# EasyEDA Pro project ProPrj_火车手动控制开关_2025-05-28.epro, board PCB2
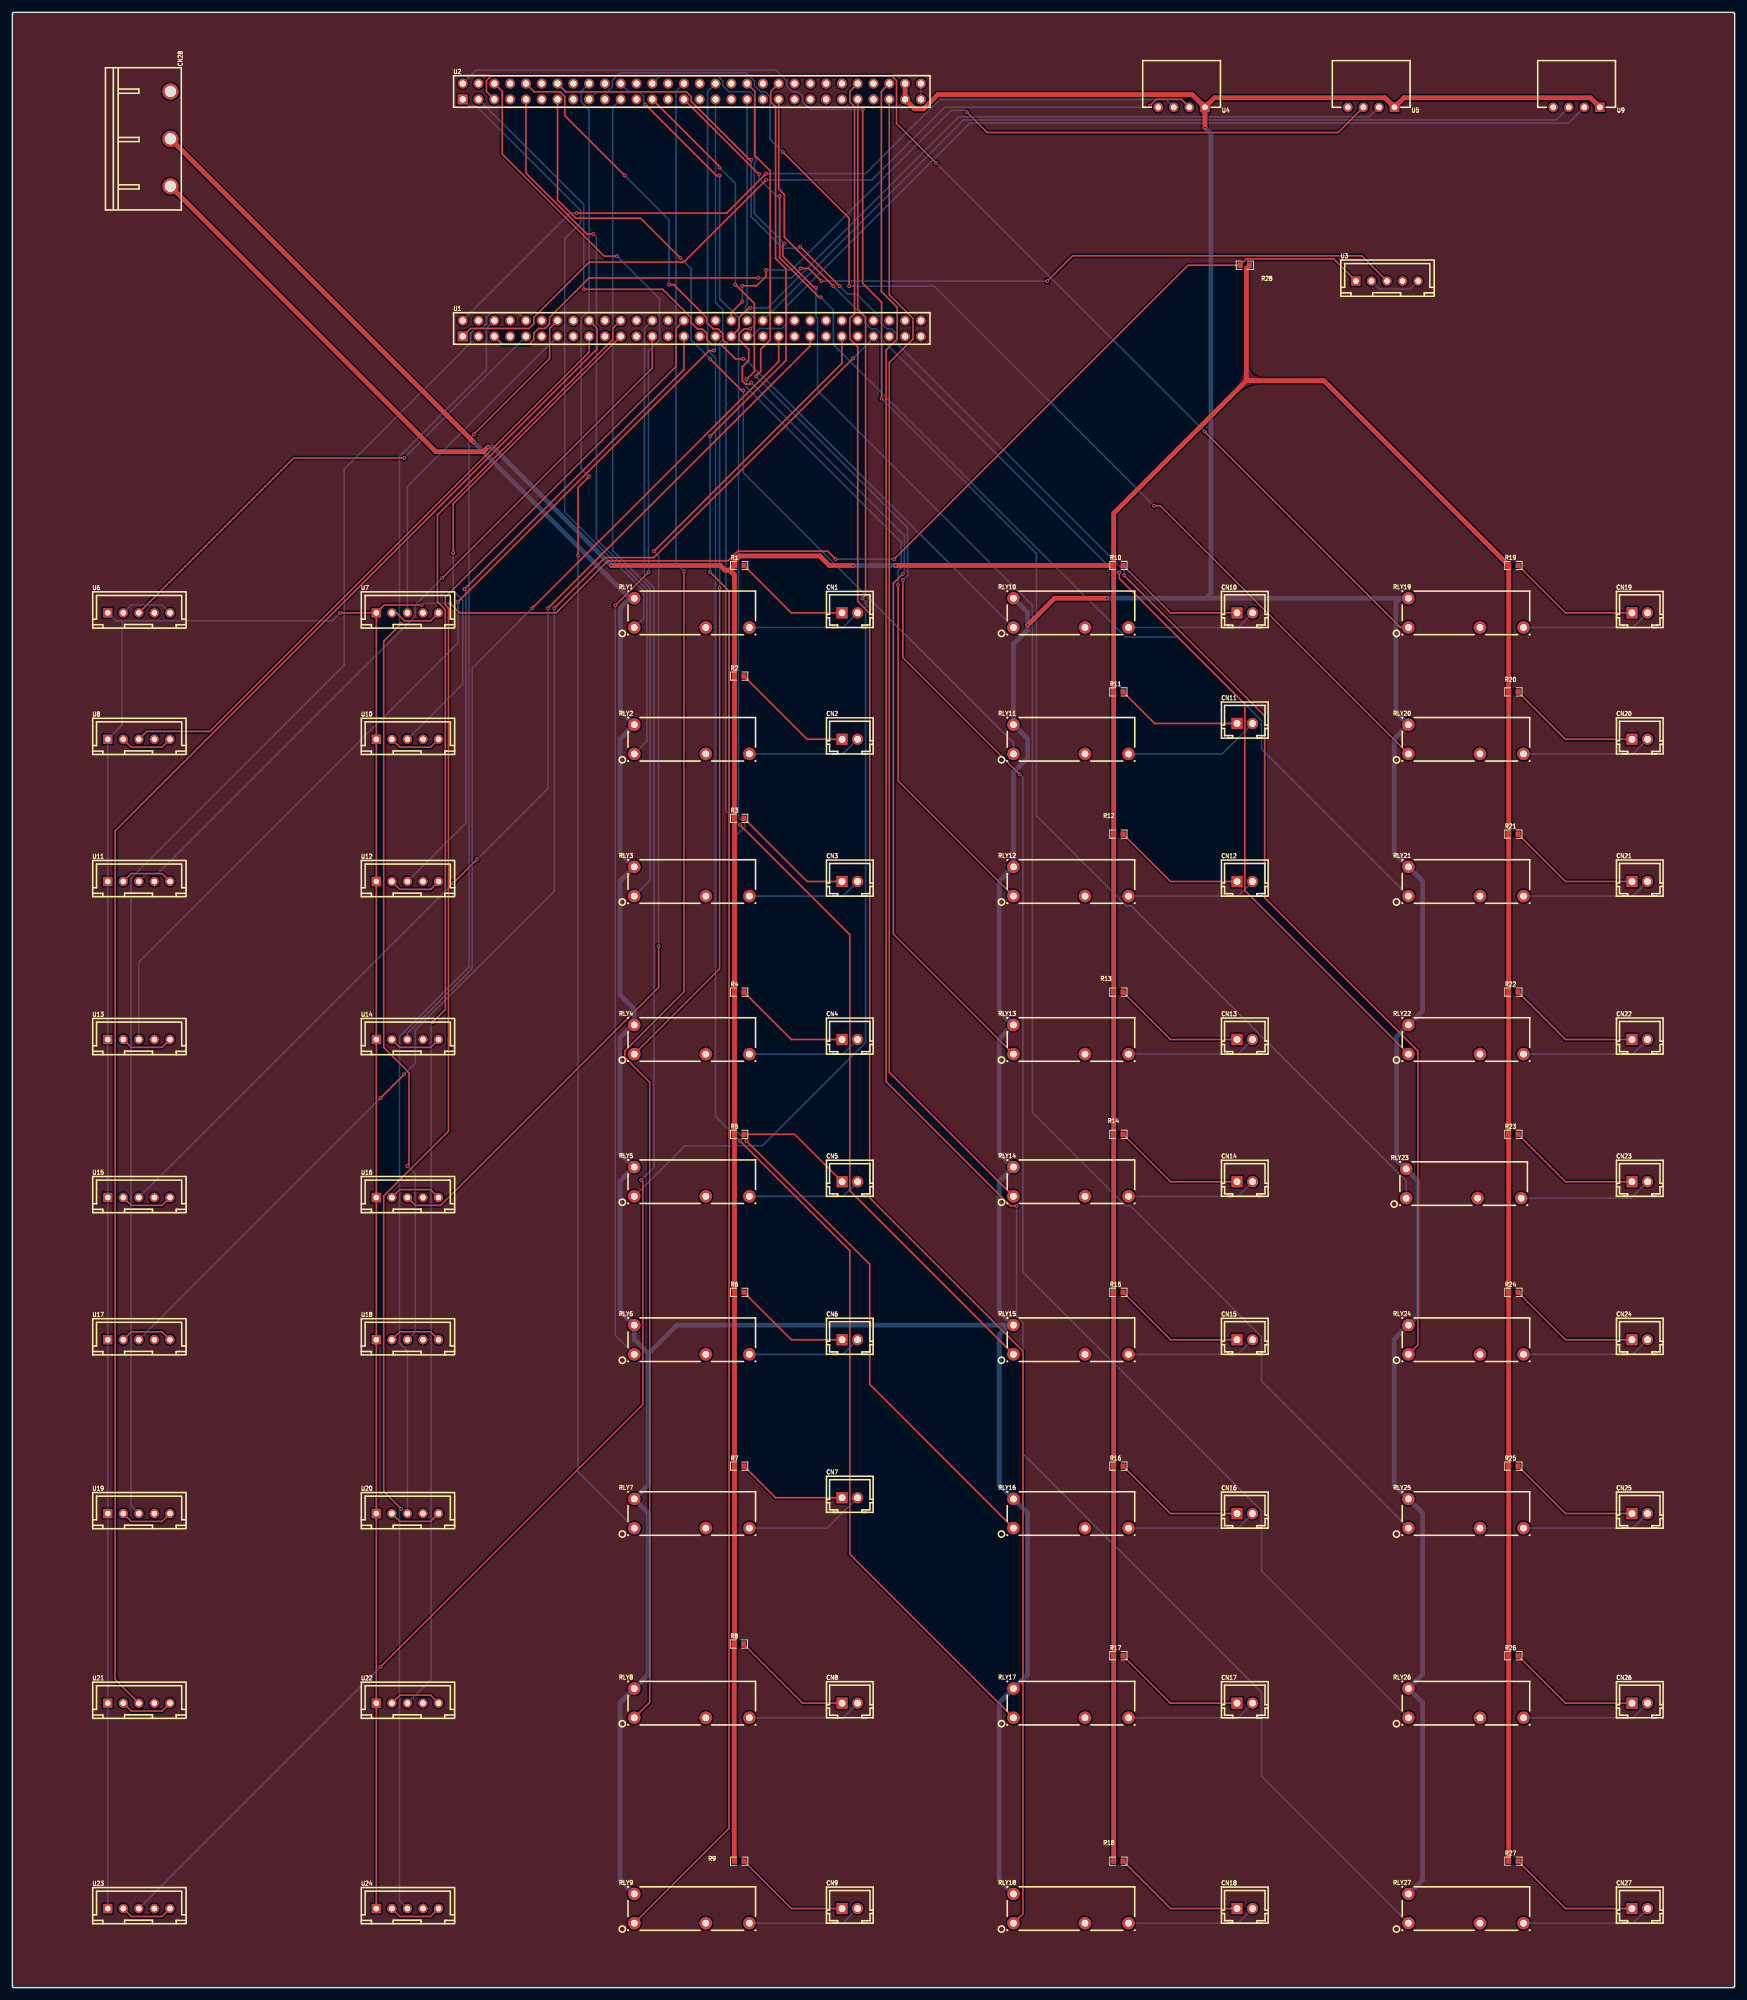
[diagram p5: board, top side]
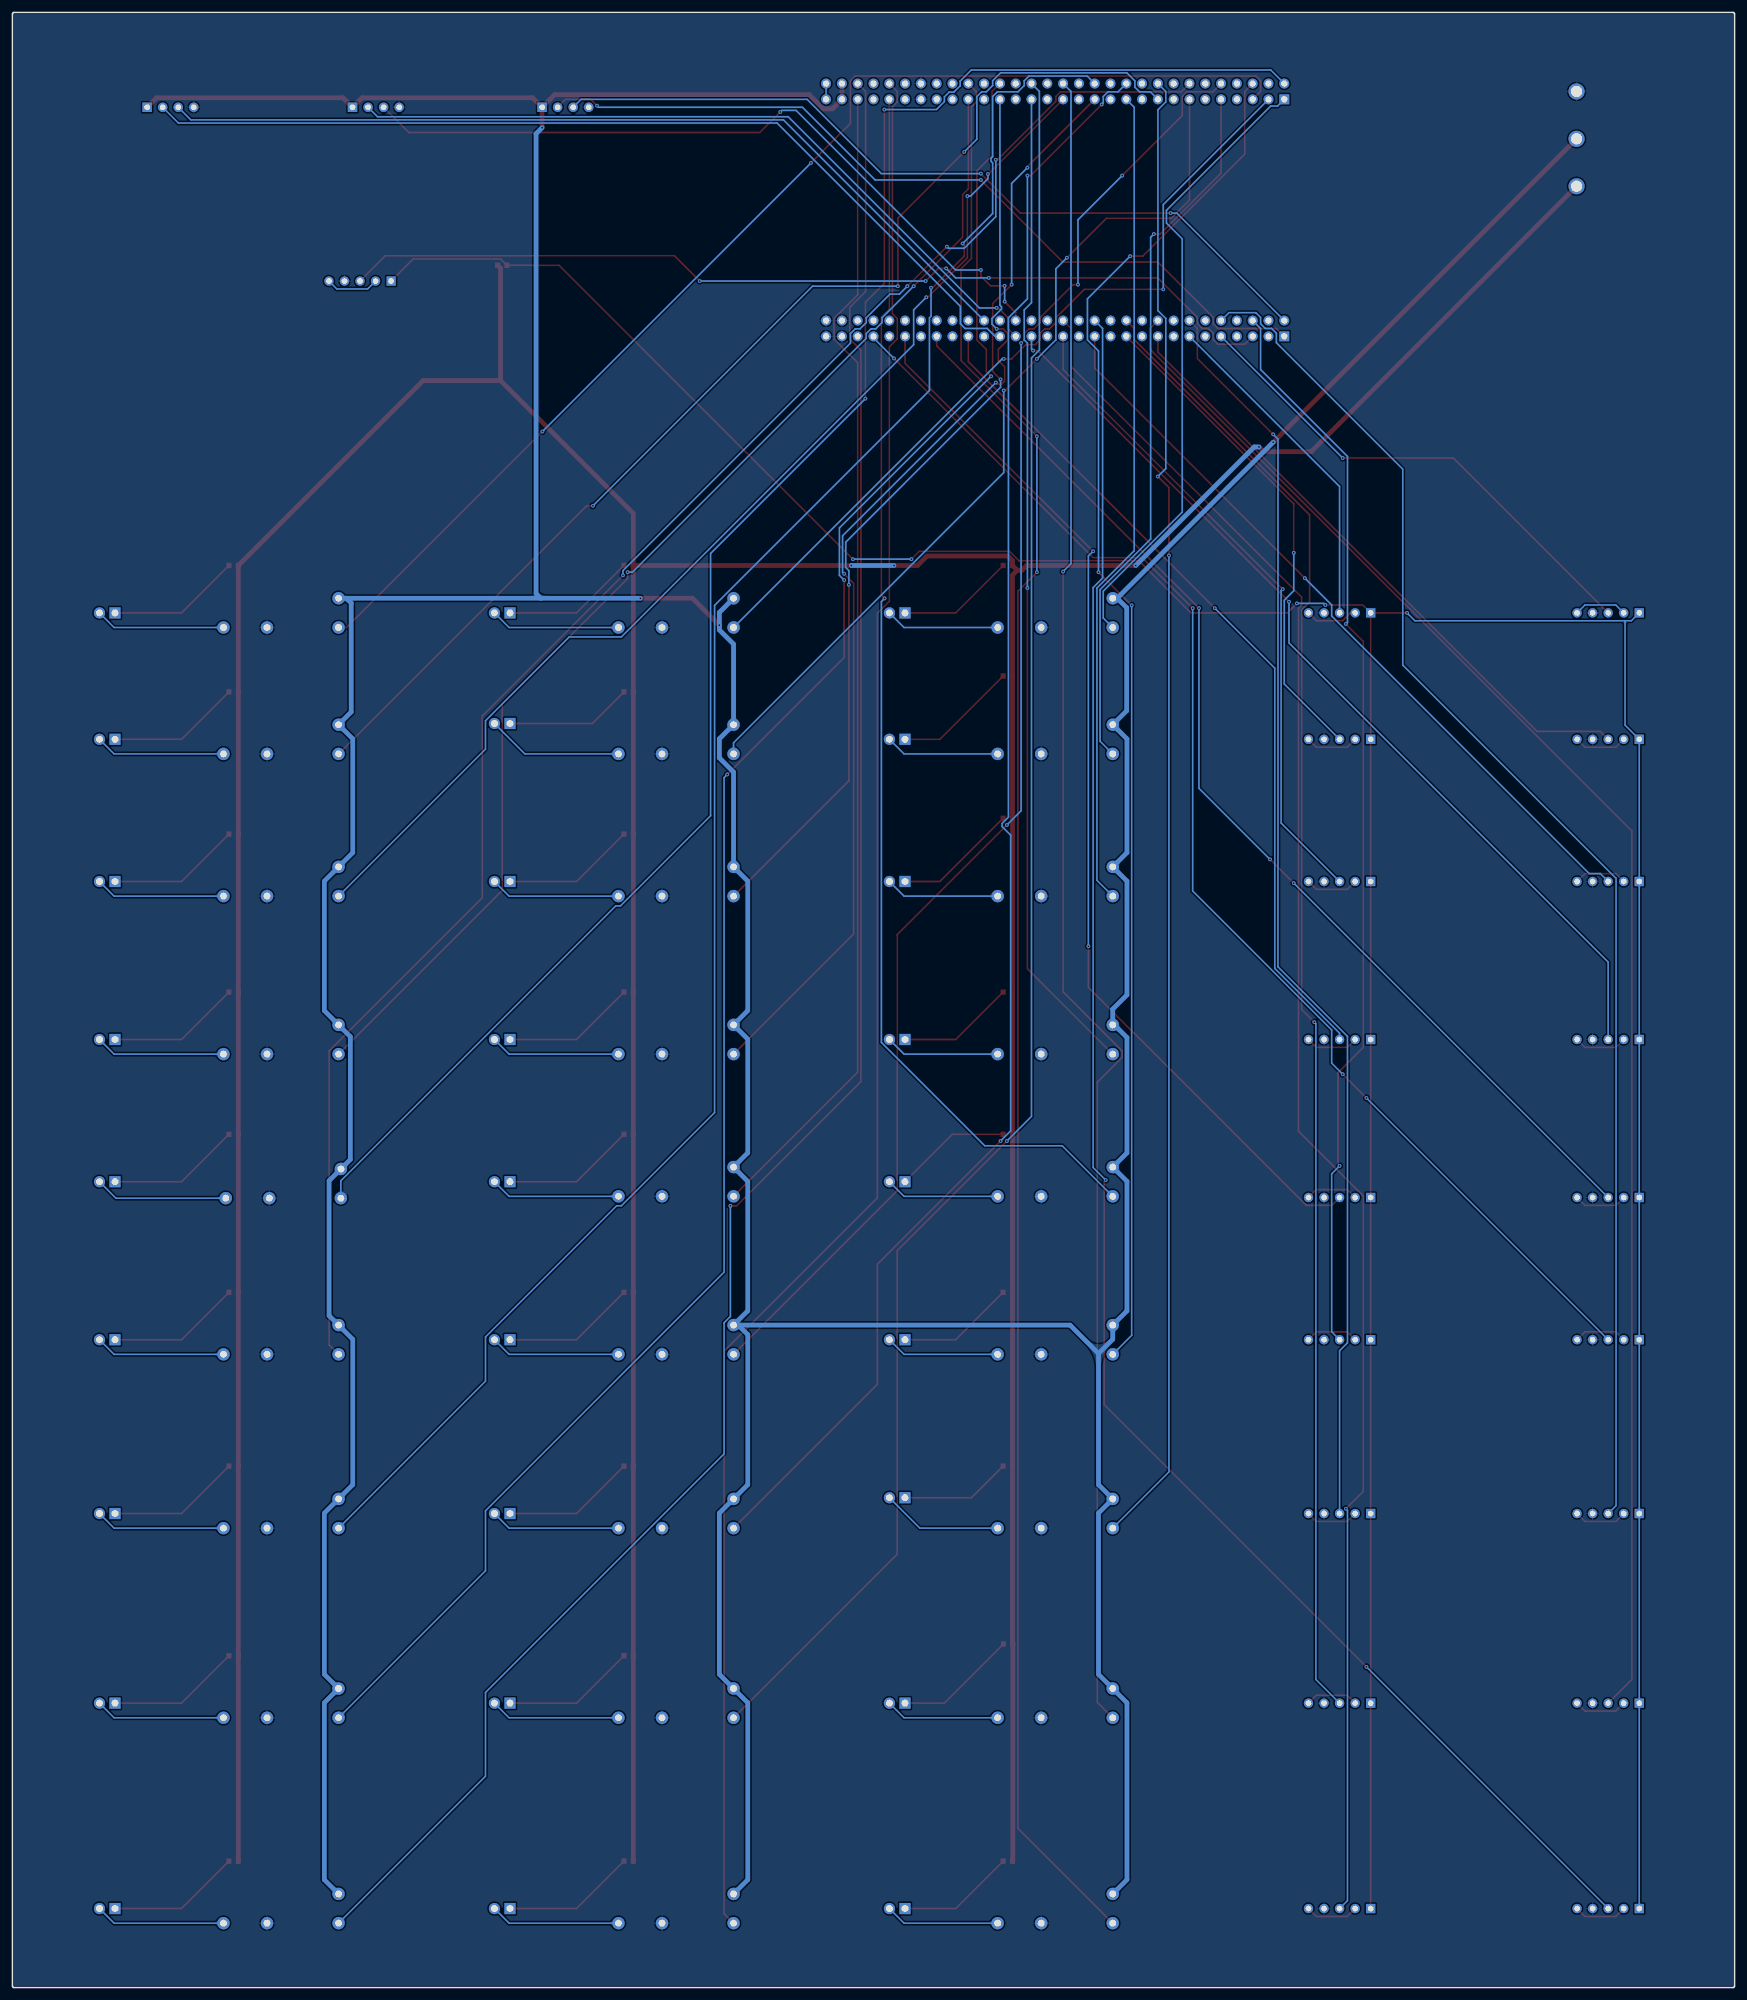
[diagram p6: board, bottom side, seen from below]

Outline 276.86 x 317.5 mm; copper layers: Top Layer, Bottom Layer. Coordinates in mm from the lower left corner of the outline.
Outline path: 0,317.25 0,0.25 arc(0.07,0.07) 0.25,0 276.61,0 arc(276.79,0.07) 276.86,0.25 276.86,317.25 arc(276.79,317.43) 276.61,317.5 0.25,317.5 arc(0.07,317.43) 0,317.25
Stack: Top Layer 0.035mm / Dielectric1 1.51mm FR4 er 4.5 / Bottom Layer 0.035mm

## Design rules (mm)
template: 自定义配置
spacing copperThickness1oz: track to track 0.102, other pairs 0.152 to 0.3
spacing copperThickness2oz (default): track to track 0.203, other pairs 0.152 to 0.3
track width copperThickness1oz: min 0.127, default 0.254, max 2.54
track width copperThickness2oz (default): min 0.203, default 0.254, max 2.54
track width trackWidth1: min 0.61, default 0.762, max 2.54
differential pair differentialPair (default): width min 0.127, default 0.254, max 2.54; gap min 0.152, default 0.152
via viaSize (default): diameter min 0.5, default 0.61, max 10; hole min 0.3, default 0.305, max 6.299
net +5V uses trackWidth1
net +24V uses trackWidth1

## Placement (name value [footprint] x y rotation side)
CN1  WAFER-XH254Z-2A  [CONN-TH_2P-P2.50_XH-2A_3045048]  134.62 220.98 0 top
CN2  WAFER-XH254Z-2A  [CONN-TH_2P-P2.50_XH-2A_3045048]  134.62 200.66 0 top
CN3  WAFER-XH254Z-2A  [CONN-TH_2P-P2.50_XH-2A_3045048]  134.62 177.8 0 top
CN4  WAFER-XH254Z-2A  [CONN-TH_2P-P2.50_XH-2A_3045048]  134.62 152.4 0 top
CN5  WAFER-XH254Z-2A  [CONN-TH_2P-P2.50_XH-2A_3045048]  134.62 129.54 0 top
CN6  WAFER-XH254Z-2A  [CONN-TH_2P-P2.50_XH-2A_3045048]  134.62 104.14 0 top
CN7  WAFER-XH254Z-2A  [CONN-TH_2P-P2.50_XH-2A_3045048]  134.62 78.74 0 top
CN8  WAFER-XH254Z-2A  [CONN-TH_2P-P2.50_XH-2A_3045048]  134.62 45.72 0 top
CN9  WAFER-XH254Z-2A  [CONN-TH_2P-P2.50_XH-2A_3045048]  134.62 12.7 0 top
CN10  WAFER-XH254Z-2A  [CONN-TH_2P-P2.50_XH-2A_3045048]  198.12 220.98 0 top
CN11  WAFER-XH254Z-2A  [CONN-TH_2P-P2.50_XH-2A_3045048]  198.12 203.2 0 top
CN12  WAFER-XH254Z-2A  [CONN-TH_2P-P2.50_XH-2A_3045048]  198.12 177.8 0 top
CN13  WAFER-XH254Z-2A  [CONN-TH_2P-P2.50_XH-2A_3045048]  198.12 152.4 0 top
CN14  WAFER-XH254Z-2A  [CONN-TH_2P-P2.50_XH-2A_3045048]  198.12 129.54 0 top
CN15  WAFER-XH254Z-2A  [CONN-TH_2P-P2.50_XH-2A_3045048]  198.12 104.14 0 top
CN16  WAFER-XH254Z-2A  [CONN-TH_2P-P2.50_XH-2A_3045048]  198.12 76.2 0 top
CN17  WAFER-XH254Z-2A  [CONN-TH_2P-P2.50_XH-2A_3045048]  198.12 45.72 0 top
CN18  WAFER-XH254Z-2A  [CONN-TH_2P-P2.50_XH-2A_3045048]  198.12 12.7 0 top
CN19  WAFER-XH254Z-2A  [CONN-TH_2P-P2.50_XH-2A_3045048]  261.62 220.98 0 top
CN20  WAFER-XH254Z-2A  [CONN-TH_2P-P2.50_XH-2A_3045048]  261.62 200.66 0 top
CN21  WAFER-XH254Z-2A  [CONN-TH_2P-P2.50_XH-2A_3045048]  261.62 177.8 0 top
CN22  WAFER-XH254Z-2A  [CONN-TH_2P-P2.50_XH-2A_3045048]  261.62 152.4 0 top
CN23  WAFER-XH254Z-2A  [CONN-TH_2P-P2.50_XH-2A_3045048]  261.62 129.54 0 top
CN24  WAFER-XH254Z-2A  [CONN-TH_2P-P2.50_XH-2A_3045048]  261.62 104.14 0 top
CN25  WAFER-XH254Z-2A  [CONN-TH_2P-P2.50_XH-2A_3045048]  261.62 76.2 0 top
CN26  WAFER-XH254Z-2A  [CONN-TH_2P-P2.50_XH-2A_3045048]  261.62 45.72 0 top
CN27  WAFER-XH254Z-2A  [CONN-TH_2P-P2.50_XH-2A_3045048]  261.62 12.7 0 top
CN28  KF2EDGRC-7.62-3P  [CONN-TH_3P-P7.62_KF2EDGRC-7.62-3P]  25.4 297.18 270 top
R1  1K  [R0603]  116.84 228.6 0 top
R2  1K  [R0603]  116.84 210.82 0 top
R3  1K  [R0603]  116.84 187.96 0 top
R4  1K  [R0603]  116.84 160.02 0 top
R5  1K  [R0603]  116.84 137.16 0 top
R6  1K  [R0603]  116.84 111.76 0 top
R7  1K  [R0603]  116.84 83.82 0 top
R8  1K  [R0603]  116.79 55.22 0 top
R9  1K  [R0603]  116.84 20.32 0 top
R10  1K  [R0603]  177.8 228.6 0 top
R11  1K  [R0603]  177.8 208.28 0 top
R12  1K  [R0603]  177.8 185.42 0 top
R13  1K  [R0603]  177.8 160.02 0 top
R14  1K  [R0603]  177.8 137.16 0 top
R15  1K  [R0603]  177.8 111.76 0 top
R16  1K  [R0603]  177.8 83.82 0 top
R17  1K  [R0603]  177.8 53.34 0 top
R18  1K  [R0603]  177.8 20.32 0 top
R19  1K  [R0603]  241.3 228.6 0 top
R20  1K  [R0603]  241.3 208.28 0 top
R21  1K  [R0603]  241.3 185.42 0 top
R22  1K  [R0603]  241.3 160.02 0 top
R23  1K  [R0603]  241.3 137.16 0 top
R24  1K  [R0603]  241.3 111.76 0 top
R25  1K  [R0603]  241.3 83.82 0 top
R26  1K  [R0603]  241.3 53.34 0 top
R27  1K  [R0603]  241.3 20.32 0 top
R28  1K  [R0603]  198.12 276.86 180 top
RLY1  HF46F/5-HS1T  [RELAYS-TH_HF46F-XX-HS1-XXX]  109.22 220.98 0 top
RLY2  HF46F/5-HS1T  [RELAYS-TH_HF46F-XX-HS1-XXX]  109.22 200.66 0 top
RLY3  HF46F/5-HS1T  [RELAYS-TH_HF46F-XX-HS1-XXX]  109.22 177.8 0 top
RLY4  HF46F/5-HS1T  [RELAYS-TH_HF46F-XX-HS1-XXX]  109.22 152.4 0 top
RLY5  HF46F/5-HS1T  [RELAYS-TH_HF46F-XX-HS1-XXX]  109.22 129.54 0 top
RLY6  HF46F/5-HS1T  [RELAYS-TH_HF46F-XX-HS1-XXX]  109.22 104.14 0 top
RLY7  HF46F/5-HS1T  [RELAYS-TH_HF46F-XX-HS1-XXX]  109.22 76.2 0 top
RLY8  HF46F/5-HS1T  [RELAYS-TH_HF46F-XX-HS1-XXX]  109.22 45.72 0 top
RLY9  HF46F/5-HS1T  [RELAYS-TH_HF46F-XX-HS1-XXX]  109.22 12.7 0 top
RLY10  HF46F/5-HS1T  [RELAYS-TH_HF46F-XX-HS1-XXX]  170.18 220.98 0 top
RLY11  HF46F/5-HS1T  [RELAYS-TH_HF46F-XX-HS1-XXX]  170.18 200.66 0 top
RLY12  HF46F/5-HS1T  [RELAYS-TH_HF46F-XX-HS1-XXX]  170.18 177.8 0 top
RLY13  HF46F/5-HS1T  [RELAYS-TH_HF46F-XX-HS1-XXX]  170.18 152.4 0 top
RLY14  HF46F/5-HS1T  [RELAYS-TH_HF46F-XX-HS1-XXX]  170.18 129.54 0 top
RLY15  HF46F/5-HS1T  [RELAYS-TH_HF46F-XX-HS1-XXX]  170.18 104.14 0 top
RLY16  HF46F/5-HS1T  [RELAYS-TH_HF46F-XX-HS1-XXX]  170.18 76.2 0 top
RLY17  HF46F/5-HS1T  [RELAYS-TH_HF46F-XX-HS1-XXX]  170.18 45.72 0 top
RLY18  HF46F/5-HS1T  [RELAYS-TH_HF46F-XX-HS1-XXX]  170.18 12.7 0 top
RLY19  HF46F/5-HS1T  [RELAYS-TH_HF46F-XX-HS1-XXX]  233.68 220.98 0 top
RLY20  HF46F/5-HS1T  [RELAYS-TH_HF46F-XX-HS1-XXX]  233.68 200.66 0 top
RLY21  HF46F/5-HS1T  [RELAYS-TH_HF46F-XX-HS1-XXX]  233.68 177.8 0 top
RLY22  HF46F/5-HS1T  [RELAYS-TH_HF46F-XX-HS1-XXX]  233.68 152.4 0 top
RLY23  HF46F/5-HS1T  [RELAYS-TH_HF46F-XX-HS1-XXX]  233.31 129.24 0 top
RLY24  HF46F/5-HS1T  [RELAYS-TH_HF46F-XX-HS1-XXX]  233.68 104.14 0 top
RLY25  HF46F/5-HS1T  [RELAYS-TH_HF46F-XX-HS1-XXX]  233.68 76.2 0 top
RLY26  HF46F/5-HS1T  [RELAYS-TH_HF46F-XX-HS1-XXX]  233.68 45.72 0 top
RLY27  HF46F/5-HS1T  [RELAYS-TH_HF46F-XX-HS1-XXX]  233.68 12.7 0 top
U1  ZX-PM2.54-2-30PY  [HDR-TH_60P-P2.54-V-F-R2-C30-S2.54]  109.22 266.7 0 top
U2  ZX-PM2.54-2-30PY  [HDR-TH_60P-P2.54-V-F-R2-C30-S2.54]  109.22 304.8 0 top
U3  WAFER-XH254Z-5A  [CONN-TH_5P-P2.50_WAFER-XH254Z-5A]  220.98 274.32 0 top
U4  WAFER-XH254WZ-4A  [CONN-TH_4P-P2.50_WAFER-XH254WZ-4A]  187.96 302.26 180 top
U5  WAFER-XH254WZ-4A  [CONN-TH_4P-P2.50_WAFER-XH254WZ-4A]  218.44 302.26 180 top
U6  WAFER-XH254Z-5A  [CONN-TH_5P-P2.50_WAFER-XH254Z-5A]  20.32 220.98 0 top
U7  WAFER-XH254Z-5A  [CONN-TH_5P-P2.50_WAFER-XH254Z-5A]  63.5 220.98 0 top
U8  WAFER-XH254Z-5A  [CONN-TH_5P-P2.50_WAFER-XH254Z-5A]  20.32 200.66 0 top
U9  WAFER-XH254WZ-4A  [CONN-TH_4P-P2.50_WAFER-XH254WZ-4A]  251.46 302.26 180 top
U10  WAFER-XH254Z-5A  [CONN-TH_5P-P2.50_WAFER-XH254Z-5A]  63.5 200.66 0 top
U11  WAFER-XH254Z-5A  [CONN-TH_5P-P2.50_WAFER-XH254Z-5A]  20.32 177.8 0 top
U12  WAFER-XH254Z-5A  [CONN-TH_5P-P2.50_WAFER-XH254Z-5A]  63.5 177.8 0 top
U13  WAFER-XH254Z-5A  [CONN-TH_5P-P2.50_WAFER-XH254Z-5A]  20.32 152.4 0 top
U14  WAFER-XH254Z-5A  [CONN-TH_5P-P2.50_WAFER-XH254Z-5A]  63.5 152.4 0 top
U15  WAFER-XH254Z-5A  [CONN-TH_5P-P2.50_WAFER-XH254Z-5A]  20.32 127 0 top
U16  WAFER-XH254Z-5A  [CONN-TH_5P-P2.50_WAFER-XH254Z-5A]  63.5 127 0 top
U17  WAFER-XH254Z-5A  [CONN-TH_5P-P2.50_WAFER-XH254Z-5A]  20.32 104.14 0 top
U18  WAFER-XH254Z-5A  [CONN-TH_5P-P2.50_WAFER-XH254Z-5A]  63.5 104.14 0 top
U19  WAFER-XH254Z-5A  [CONN-TH_5P-P2.50_WAFER-XH254Z-5A]  20.32 76.2 0 top
U20  WAFER-XH254Z-5A  [CONN-TH_5P-P2.50_WAFER-XH254Z-5A]  63.5 76.2 0 top
U21  WAFER-XH254Z-5A  [CONN-TH_5P-P2.50_WAFER-XH254Z-5A]  20.32 45.72 0 top
U22  WAFER-XH254Z-5A  [CONN-TH_5P-P2.50_WAFER-XH254Z-5A]  63.5 45.72 0 top
U23  WAFER-XH254Z-5A  [CONN-TH_5P-P2.50_WAFER-XH254Z-5A]  20.32 12.7 0 top
U24  WAFER-XH254Z-5A  [CONN-TH_5P-P2.50_WAFER-XH254Z-5A]  63.5 12.7 0 top

## Footprints (pads in the part's own frame, mm; a bottom-side part is the same pattern mirrored in y, then rotated)
CONN-TH_2P-P2.50_XH-2A_3045048
  rect 1.8x1.8 hole 1.1: 1(-1.25,0)
  round 1.8 hole 1.1: 2(1.25,0)
CONN-TH_3P-P7.62_KF2EDGRC-7.62-3P
  round 2.6 hole 1.8: 1(-7.62,0) 2(0,0) 3(7.62,0)
CONN-TH_4P-P2.50_WAFER-XH254WZ-4A
  rect 1.524x1.524 hole 0.914: 1(-3.75,0)
  round 1.524 hole 0.914: 2(-1.25,0) 3(1.25,0) 4(3.75,0)
CONN-TH_5P-P2.50_WAFER-XH254Z-5A
  rect 1.5x1.5 hole 0.9: 1(-5,0)
  round 1.5 hole 0.9: 2(-2.5,0) 3(0,0) 4(2.5,0) 5(5,0)
HDR-TH_60P-P2.54-V-F-R2-C30-S2.54
  rect 1.6x1.6 hole 1: 1(-36.83,-1.27)
  round 1.6 hole 1: 2(-36.83,1.27) 3(-34.29,-1.27) 4(-34.29,1.27) 5(-31.75,-1.27) 6(-31.75,1.27) 7(-29.21,-1.27) 8(-29.21,1.27) 9(-26.67,-1.27) 10(-26.67,1.27) 11(-24.13,-1.27) 12(-24.13,1.27) 13(-21.59,-1.27) 14(-21.59,1.27) 15(-19.05,-1.27) 16(-19.05,1.27) 17(-16.51,-1.27) 18(-16.51,1.27) 19(-13.97,-1.27) 20(-13.97,1.27) 21(-11.43,-1.27) 22(-11.43,1.27) 23(-8.89,-1.27) 24(-8.89,1.27) 25(-6.35,-1.27) 26(-6.35,1.27) 27(-3.81,-1.27) 28(-3.81,1.27) 29(-1.27,-1.27) 30(-1.27,1.27) 31(1.27,-1.27) 32(1.27,1.27) 33(3.81,-1.27) 34(3.81,1.27) 35(6.35,-1.27) 36(6.35,1.27) 37(8.89,-1.27) 38(8.89,1.27) 39(11.43,-1.27) 40(11.43,1.27) 41(13.97,-1.27) 42(13.97,1.27) 43(16.51,-1.27) 44(16.51,1.27) 45(19.05,-1.27) 46(19.05,1.27) 47(21.59,-1.27) 48(21.59,1.27) 49(24.13,-1.27) 50(24.13,1.27) 51(26.67,-1.27) 52(26.67,1.27) 53(29.21,-1.27) 54(29.21,1.27) 55(31.75,-1.27) 56(31.75,1.27) 57(34.29,-1.27) 58(34.29,1.27) 59(36.83,-1.27) 60(36.83,1.27)
R0603
  rect 0.806x0.864 smd: 1(-0.753,0) 2(0.753,0)
RELAYS-TH_HF46F-XX-HS1-XXX
  round 2 hole 1.1: 1(-9.25,-2.35) 2(2.25,-2.35) 3(9.25,-2.35) 6(-9.25,2.35)

## Nets
As in the schematic.

Pads without a net: U1 3 4 7 8 11 12 15 16 19 20 23 24 27 28 31 32 34 38 39 42 43 44 46 47 48 50 51 52 54 55 56; U2 4 7 8 11 12 15 16 19 20 23 24 27 28 31 32 35 36 39 40 43 44 45 46 49 50 53 54

## Via types
v1: diameter 0.61, hole 0.305, Top Layer to Bottom Layer, 102 vias

## Routing (per net, layer and track width the routed paths; a pad name or vN(x,y) marks a point on that pad's centre or on a via; arc(x,y) is an arc through that point)
3.3V: length 2.5
  Bottom Layer w0.254: U2.59 U2.60
+5V: length 1095.8
  Top Layer w0.762: U9.1 253.69,303.78 223.71,303.78 U5.1 220.67,303.78 193.23,303.78 U4.1 ; U2.58 U2.57 145.03,302.01 146.5,302.01 148.78,304.29 189.68,304.29 U4.1 ; v1(163.22,219.01) 167.53,223.33 v1(175.92,223.33) ; CN28.2 v1(74.17,248.41) ; v1(191.71,298.98) U4.1
  Bottom Layer w0.762: RLY9.6 97.68,17.34 97.68,45.78 RLY8.6 102.26,50.36 102.26,76.26 RLY7.6 102.26,80.84 102.26,101.92 ; 99.97,155 97.68,152.72 97.68,134.18 RLY5.6 97.68,129.6 97.68,108.78 RLY6.6 99.97,104.2 102.26,101.92 ; 99.97,155 99.97,157.29 97.68,159.58 97.68,177.86 RLY3.6 97.68,182.44 97.68,200.72 RLY2.6 97.73,205.25 97.73,221.81 99.25,223.33 ; 99.97,155 RLY4.6 ; 223.16,223.33 RLY19.6 ; 223.16,223.33 222.4,222.57 222.4,205.04 RLY20.6 222.14,200.72 222.14,182.44 RLY21.6 226.72,177.86 226.72,157.04 RLY22.6 222.54,152.86 222.54,133.11 RLY23.6 225.95,129.7 225.95,108.01 RLY24.6 222.14,104.2 222.14,80.84 RLY25.6 226.72,76.26 226.72,50.36 RLY26.6 226.72,45.78 226.72,17.34 RLY27.6 ; 223.16,223.33 191.92,223.33 ; v1(191.71,298.98) 192.68,298.01 192.68,224.09 191.92,223.33 ; RLY10.6 163.22,221.04 v1(163.22,219.01) 163.22,218.25 160.93,215.96 RLY11.6 163.22,200.72 163.22,197.68 160.93,195.39 RLY12.6 158.64,177.86 158.64,157.04 RLY13.6 158.64,152.46 158.64,134.18 RLY14.6 158.64,129.6 158.64,108.78 RLY15.6 160.17,106.49 ; 102.26,101.92 106.83,106.49 160.17,106.49 ; 160.17,106.49 158.64,104.97 158.64,80.84 RLY16.6 163.22,76.26 163.22,50.36 RLY17.6 158.64,45.78 158.64,17.34 RLY18.6 ; 191.92,223.33 v1(175.92,223.33) ; 99.25,223.33 RLY1.6 ; 99.25,223.33 v1(74.17,248.41)
+24V: length 916.1
  Top Layer w0.762: v1(96.27,228.6) 113.79,228.6 114.55,227.84 115.32,227.84 ; 115.32,227.84 R1.1 116.09,229.36 116.85,230.12 129.8,230.12 131.33,228.6 v1(135.14,228.6) ; 115.32,227.84 116.09,227.07 R2.1 R3.1 R4.1 R5.1 R6.1 R7.1 116.09,55.27 R8.1 116.04,20.37 R9.1 ; CN28.3 68.07,246.89 75.69,246.89 v1(76.45,247.65) ; R27.1 R26.1 R25.1 R24.1 R23.1 R22.1 R21.1 R20.1 R19.1 210.83,258.32 198.38,258.32 ; 198.38,258.32 177.05,236.98 R10.1 ; 198.38,258.32 198.38,276.37 R28.1 ; v1(141.99,228.6) R10.1 ; R10.1 R11.1 R12.1 R13.1 R14.1 R15.1 R16.1 R17.1 R18.1
  Bottom Layer w0.762: v1(135.14,228.6) v1(141.99,228.6) ; v1(96.27,228.6) 77.22,247.65 v1(76.45,247.65)
LED1: length 100.3
  Bottom Layer w0.254: RLY1.1 101.49,220.15 101.49,224.47 88.79,237.17 88.79,281.11 91.33,283.65 91.33,285.69 74.57,302.45 73.47,302.45 U2.1
LED2: length 130.2
  Top Layer w0.254: v1(117.5,261.81) 116.23,261.81 113.94,264.1 112.42,264.1 111.65,264.86 111.65,265.87 110.89,266.64 110.13,266.64 109.11,267.65 109.11,268.41 104.54,272.99 v1(91.84,272.99)
  Bottom Layer w0.254: RLY10.1 117.75,261.81 v1(117.5,261.81) ; v1(91.84,272.99) 91.84,286.62 U2.3
LED3: length 192.8
  Top Layer w0.254: U2.5 76.2,304.8 76.2,306.51 76.96,307.28 141.37,307.28 142.13,306.51 142.13,299.66 v1(148.48,293.31) ; v1(191.66,250.13) 223.16,218.63 RLY19.1
  Bottom Layer w0.254: v1(191.66,250.13) v1(148.48,293.31)
LED4: length 114.7
  Top Layer w0.254: U2.9 82.55,291.68 92.35,281.88 v1(93.37,281.88)
  Bottom Layer w0.254: RLY2.1 102,200.34 102,224.73 93.87,232.85 93.87,281.37 v1(93.37,281.88)
LED5: length 141.8
  Top Layer w0.254: v1(112.16,261.81) 117.24,256.73 v1(117.5,256.73) ; U2.13 87.63,287.36 90.57,284.42 100.99,284.42 v1(107.34,278.07)
  Bottom Layer w0.254: v1(112.16,261.81) 109.11,264.86 109.11,276.29 v1(107.34,278.07) ; v1(117.5,256.73) 117.5,243.52 160.93,200.09 RLY11.1
LED6: length 190.3
  Top Layer w0.254: v1(134.51,273.49) 134.51,284.42 v1(123.85,295.08) ; RLY20.1 184.55,238.19 v1(183.54,238.19)
  Bottom Layer w0.254: U2.17 93.92,304.74 95.65,304.74 96.41,305.5 96.41,306.51 97.68,307.78 118,307.78 119.27,306.51 119.27,305.75 120.29,304.74 121.05,304.74 121.81,303.97 121.81,297.12 v1(123.85,295.08) ; v1(183.54,238.19) 148.23,273.49 v1(134.51,273.49)
LED7: length 132.1
  Bottom Layer w0.254: U2.21 96.52,302.26 96.52,230.97 102.51,224.98 102.51,177.99 RLY3.1
LED8: length 153.6
  Top Layer w0.254: v1(118,258.51) 119.27,259.78 119.27,270.7 v1(116.23,273.75) ; RLY12.1 142.39,193.99 v1(142.39,225.49) ; v1(113.69,292.54) 113.69,292.71 U2.25
  Bottom Layer w0.254: v1(116.23,273.75) 116.23,290 v1(113.69,292.54) ; v1(118,258.51) 118,257.24 142.9,232.35 142.9,228.28 142.39,227.77 v1(142.39,225.49)
LED9: length 181.7
  Top Layer w0.254: U2.29 119.95,291.53 v1(120.04,291.53) ; v1(123.34,287.97) 123.34,278.07 129.69,271.72 v1(129.94,271.72)
  Bottom Layer w0.254: v1(120.04,291.53) 120.04,290.77 122.83,287.97 v1(123.34,287.97) ; v1(129.94,271.72) 131.97,269.68 131.97,264.1 178.96,217.11 187.35,217.11 200.81,203.64 200.81,199.07 RLY21.1
LED10: length 159.9
  Top Layer w0.254: RLY4.1 113.69,163.77 v1(113.69,224.98)
  Bottom Layer w0.254: U2.33 113.03,270.85 114.19,269.68 114.19,264.86 113.69,264.35 v1(113.69,224.98)
LED11: length 177.3
  Top Layer w0.254: v1(118.77,258) 118.51,257.75 117.86,257.75 117.35,258.25 117.35,260.54 118.36,261.56 118.36,263.33 116.84,264.86 116.84,265.87 117.6,266.64 v1(118.62,266.64) ; v1(143.15,227.27) 141.63,225.74 141.63,169.35 RLY13.1
  Bottom Layer w0.254: v1(143.15,227.27) 143.4,227.52 143.4,233.36 v1(118.77,258) ; U2.37 118.11,270.45 117.86,270.19 117.86,269.83 119.38,268.3 119.38,267.4 v1(118.62,266.64)
LED12: length 196.3
  Top Layer w0.254: RLY22.1 198.11,176.37 198.11,206.34 177.95,226.5 v1(177.95,227.52) ; v1(131.97,273.49) 124.1,281.37 124.1,288.23 123.19,289.14 U2.41
  Bottom Layer w0.254: v1(177.95,227.52) 177.19,227.52 139.59,265.11 139.59,265.87 138.83,266.64 138.07,266.64 137.05,267.65 137.05,268.41 v1(131.97,273.49)
LED13: length 200
  Top Layer w0.254: U2.51 135.89,269.79 137.16,268.52 137.16,223.82 v1(136.65,223.31)
  Bottom Layer w0.254: RLY5.1 108.1,135.32 120.54,135.32 137.16,151.93 137.16,222.8 v1(136.65,223.31)
LED14: length 187.8
  Top Layer w0.254: U2.55 140.97,272.12 144.78,268.31 144.78,265.01 140.97,261.2 140.97,147.15 RLY14.1
LED15: length 280.4
  Top Layer w0.254: v1(139.73,255.41) 139.73,270.91 136.68,273.96 v1(136.68,301.9)
  Bottom Layer w0.254: RLY23.1 224.06,129.68 179.86,173.88 179.1,173.88 164.62,188.36 164.62,230.52 v1(139.73,255.41) ; U2.2 74.57,308.25 122.71,308.25 124.49,306.47 124.49,305.71 125.51,304.69 126.27,304.69 127.03,303.93 127.03,303.17 128.3,301.9 v1(136.68,301.9)
LED16: length 220.7
  Top Layer w0.254: v1(97.18,278.32) 95.14,278.32 78.74,294.72 78.74,304.8 U2.6 ; v1(96.92,222.19) v1(102.26,227.52)
  Bottom Layer w0.254: RLY6.1 96.92,104.84 v1(96.92,222.19) ; v1(97.18,278.32) 104.03,271.46 104.03,264.86 102.26,263.08 v1(102.26,227.52)
LED17: length 240.1
  Top Layer w0.254: v1(105.56,273.75) 106.32,273.75 111.65,268.41 111.65,267.65 112.67,266.64 113.43,266.64 114.19,265.87 114.19,264.86 v1(114.7,264.35) ; v1(98.45,291.27) 88.79,300.93 88.79,303.97 88.03,304.74 83.88,304.74 U2.10 ; RLY15.1 134.61,128.11 134.61,169.25 v1(116.99,186.88)
  Bottom Layer w0.254: v1(98.45,291.27) 105.56,284.16 v1(105.56,273.75) ; v1(116.99,186.88) 114.7,189.17 v1(114.7,264.35)
LED18: length 277
  Top Layer w0.254: v1(178.71,227.01) 201.32,204.41 201.32,175.2 225.95,150.56 225.95,103.31 RLY24.1 ; v1(132.99,273.49) v1(126.64,279.84) ; v1(118.77,293.81) 118.51,293.81 109.11,303.21 109.11,303.97 108.35,304.74 88.96,304.74 U2.14
  Bottom Layer w0.254: v1(178.71,227.01) 178.71,227.77 142.13,264.35 142.13,265.87 141.37,266.64 140.61,266.64 139.59,267.65 139.59,268.41 135.78,272.22 134.26,272.22 v1(132.99,273.49) ; v1(126.64,279.84) 126.39,279.59 123.85,279.59 118.77,284.67 v1(118.77,293.81)
LED19: length 238.8
  Top Layer w0.254: v1(92.71,242.91) 90.93,241.13 v1(90.93,230.21)
  Bottom Layer w0.254: v1(92.71,242.91) 91.44,244.18 91.44,268.31 92.71,269.58 92.71,301.84 91.44,303.11 91.44,304.8 U2.18 ; v1(90.93,230.21) 90.93,82.89 RLY7.1
LED20: length 260.7
  Top Layer w0.254: v1(113.69,291.27) 113.18,291.27 v1(101.75,302.7) ; v1(118,136.08) 137.82,116.27 137.82,96.96 RLY16.1
  Bottom Layer w0.254: v1(118,136.08) 116.38,137.7 116.38,185.26 117.75,186.63 117.75,187.13 116.73,188.15 116.73,268.41 113.69,271.46 v1(113.69,291.27) ; U2.22 99.12,304.74 100.73,304.74 101.49,303.97 101.49,302.96 v1(101.75,302.7)
LED21: length 293.4
  Top Layer w0.254: v1(129.18,273.24) 128.93,273.24 123.85,278.32 123.85,280.1 v1(124.1,280.35)
  Bottom Layer w0.254: U2.26 104.08,307.28 113.43,307.28 114.19,306.51 114.19,305.75 115.21,304.74 118.51,304.74 119.27,303.97 119.27,294.32 119.53,294.07 119.53,293.56 119.27,293.31 119.27,285.18 v1(124.1,280.35) ; RLY25.1 200.81,97.47 200.81,104.58 179.73,125.67 178.96,125.67 163.98,140.65 163.98,222.19 129.43,256.73 129.43,268.41 129.18,268.67 v1(129.18,273.24)
LED22: length 270.4
  Top Layer w0.254: v1(107.95,227.63) 107.95,160.06 98.45,150.56 98.45,149.54 102.46,145.53 102.46,45.86 RLY8.1
  Bottom Layer w0.254: v1(107.95,227.63) 106.68,228.9 106.68,304.8 U2.30
LED23: length 283.6
  Top Layer w0.254: RLY17.1 134.61,69.69 134.61,118.45 v1(116.99,136.08)
  Bottom Layer w0.254: U2.34 111.76,304.8 111.76,263.23 113.03,261.96 113.03,140.04 v1(116.99,136.08)
LED24: length 309.3
  Top Layer w0.254: v1(161.95,195.01) 143.15,213.8 v1(143.15,226.25) ; v1(119.53,259.02) 120.29,259.78 120.29,263.33 121.81,264.86 121.81,292.04 119.38,294.47 119.38,304.8 U2.38
  Bottom Layer w0.254: v1(143.15,226.25) 143.91,227.01 143.91,234.63 v1(119.53,259.02) ; RLY26.1 200.81,66.99 200.81,76.64 162.45,115 162.45,194.5 v1(161.95,195.01)
LED25: length 309.9
  Top Layer w0.254: U2.42 121.92,304.8 121.92,303.11 122.68,302.34 122.68,277.96 124.35,276.29 124.35,261.56 v1(112.16,249.36) ; v1(112.16,227.52) 115.21,224.47 115.21,25.59 RLY9.1
  Bottom Layer w0.254: v1(112.16,227.52) v1(112.16,249.36)
LED26: length 309
  Top Layer w0.254: RLY18.1 162.45,11.87 162.45,102.3 137.82,126.94 137.82,220.92 135.89,222.84 135.89,263.74 134.62,265.01 134.62,268.31 135.38,269.07 135.38,302.34 134.62,303.11 134.62,304.8 U2.52
LED27: length 333.4
  Top Layer w0.254: U2.56 139.7,304.8 139.7,272.63 142.24,270.09 142.24,265.01 140.46,263.23 140.46,145.63 160.42,125.67 v1(161.44,125.67)
  Bottom Layer w0.254: RLY27.1 200.81,33.97 200.81,47.43 162.45,85.79 162.45,106.87 161.44,107.89 v1(161.44,125.67)
PA8: length 202.8
  Top Layer w0.254: U1.14 86.36,266.7 86.36,261.87 v1(74.17,249.68)
  Bottom Layer w0.254: v1(74.17,249.68) 73.41,248.92 73.41,164.08 62.23,152.91 62.23,103.63 63.5,102.36 U20.3
PA15: length 100.7
  Top Layer w0.254: U8.3 21.59,201.93 31.75,201.93 92.71,262.89 U1.17
PB4: length 151.9
  Top Layer w0.254: v1(71.63,222.76) 112.01,263.14 v1(112.78,263.14)
  Bottom Layer w0.254: v1(112.78,263.14) 113.03,263.4 U1.33 ; v1(71.63,222.76) 71.63,216.15 20.32,164.85 U13.3
PB5: length 121.6
  Top Layer w0.254: v1(117.35,273.56) 119.63,273.56 121.16,275.08 v1(121.16,276.1) ; U1.36 115.57,269.24 v1(117.35,271.02) ; v1(153.42,301.5) 156.72,298.2 213.13,298.2 U5.3
  Bottom Layer w0.254: v1(153.42,301.5) 153.16,301.75 150.88,301.75 125.22,276.1 v1(121.16,276.1) ; v1(117.35,271.02) v1(117.35,273.56)
PB6: length 120.4
  Top Layer w0.254: U1.35 116.84,266.7 116.84,268.48 118.36,270 v1(118.62,270)
  Bottom Layer w0.254: U5.2 218.17,300.74 152.15,300.74 121.41,270 v1(118.62,270)
PC6: length 224.3
  Bottom Layer w0.254: U1.10 81.28,269.24 76.96,269.24 76.2,268.48 76.2,267.46 75.44,266.7 74.42,266.7 73.66,265.94 73.66,264.41 53.34,244.09 53.34,212.6 19.05,178.31 19.05,77.47 U19.3
PC7: length 80.6
  Top Layer w0.254: v1(62.99,245.87) 45.21,245.87 U6.3
  Bottom Layer w0.254: U1.9 v1(62.99,245.87)
PC11: length 54.4
  Bottom Layer w0.254: U1.13 63.5,241.3 U7.3
PD1: length 256.4
  Top Layer w0.254: U21.3 16.51,49.53 16.51,185.93 93.98,263.4 93.98,266.7 U1.18
PD3: length 237.5
  Top Layer w0.254: U1.22 96.52,266.7 96.52,264.92 68.33,236.73 68.33,222.76 69.6,221.49 69.6,157.23 v1(67.56,155.19)
  Bottom Layer w0.254: v1(67.56,155.19) 67.31,154.94 67.31,49.53 U22.3
PD4: length 80.2
  Top Layer w0.254: v1(70.87,230.63) 70.87,238.51 U1.21
  Bottom Layer w0.254: v1(70.87,230.63) 70.87,224.54 72.39,223.01 72.39,209.55 U10.3
PD7: length 290.9
  Top Layer w0.254: v1(101.09,129.79) 101.35,129.54 101.35,93.73 v1(59.18,51.56)
  Bottom Layer w0.254: U1.26 101.6,266.7 101.6,226.57 103.12,225.04 103.12,131.83 v1(101.09,129.79) ; v1(59.18,51.56) U23.3
PD14: length 129.6
  Top Layer w0.254: v1(121.16,291.59) 114.81,285.24 v1(90.68,285.24)
  Bottom Layer w0.254: v1(90.68,285.24) 89.66,285.24 U1.2 ; U4.3 185.44,303.53 149.1,303.53 137.16,291.59 v1(121.16,291.59)
PD15: length 133.7
  Top Layer w0.254: U4.2 187.94,303.53 183.9,303.53 v1(182.88,302.51) ; v1(121.16,290.58) 107.95,277.37 92.71,277.37 83.82,268.48 83.82,267.46 83.06,266.7 73.66,266.7 U1.1
  Bottom Layer w0.254: v1(182.88,302.51) 182.63,302.26 149.86,302.26 138.18,290.58 v1(121.16,290.58)
PE0: length 143.8
  Bottom Layer w0.254: U9.3 248.18,300.23 152.91,300.23 U1.40
PE1: length 151.5
  Bottom Layer w0.254: U1.37 118.87,265.43 120.14,266.7 123.7,266.7 124.46,267.46 124.46,270.26 153.92,299.72 250.17,299.72 U9.2
PE2: length 137.8
  Top Layer w0.254: U1.41 123.19,261.37 v1(83.57,221.74)
  Bottom Layer w0.254: U14.3 63.5,153.42 73.91,163.83 73.91,212.09 v1(83.57,221.74)
PE6: length 183.1
  Top Layer w0.254: U1.45 128.27,263.91 v1(86.11,221.74) ; v1(74.68,181.36) v1(70.87,177.55)
  Bottom Layer w0.254: v1(86.11,221.74) 86.11,192.79 v1(74.68,181.36) ; v1(70.87,177.55) U15.3
PF0: length 214.8
  Top Layer w0.254: v1(135.13,261.87) 103.12,229.87 95.25,229.87 v1(87.12,221.74) ; v1(62.99,146.81) v1(59.18,143)
  Bottom Layer w0.254: v1(59.18,143) U17.3 ; v1(87.12,221.74) 87.12,176.28 64.77,153.92 64.77,148.59 v1(62.99,146.81) ; v1(135.13,261.87) 138.43,265.18 U1.53
PF3: length 172.9
  Top Layer w0.254: v1(103.12,230.89) 133.35,261.11 U1.49 ; U16.3 64.77,125.73 68.83,125.73 103.89,160.78 v1(103.89,167.39)
  Bottom Layer w0.254: v1(103.89,167.39) 103.89,230.12 v1(103.12,230.89)
PG4: length 174.2
  Top Layer w0.254: v1(63.5,132.08) 63.75,132.33 63.75,147.07 59.69,151.13 59.69,216.41 v1(62.48,219.2)
  Bottom Layer w0.254: U18.3 64.77,105.41 64.77,130.81 v1(63.5,132.08) ; v1(62.48,219.2) 62.23,219.46 62.23,246.13 76.2,260.1 76.2,266.7 U1.6
PG5: length 154.5
  Top Layer w0.254: v1(119.89,274.83) 92.71,274.83 86.36,268.48 86.36,267.46 85.6,266.7 84.58,266.7 83.82,265.94 83.82,264.92 83.06,264.16 78.74,264.16 U1.5 ; v1(130.05,274.32) 128.02,276.35 v1(126.75,276.35) ; v1(166.37,274.32) 170.43,278.38 216.92,278.38 U3.3
  Bottom Layer w0.254: v1(126.75,276.35) 125.22,274.83 v1(119.89,274.83) ; v1(130.05,274.32) v1(166.37,274.32)
PG9: length 122.9
  Top Layer w0.254: U1.25 102.87,260.35 v1(69.09,226.57)
  Bottom Layer w0.254: v1(69.09,226.57) 64.77,222.25 64.77,220.47 23.37,179.07 21.59,179.07 U11.3
PG12: length 277.5
  Top Layer w0.254: v1(62.48,76.96) 59.69,79.76 59.69,127.25 70.1,137.67 70.1,221.74 69.6,222.25 69.6,223.52 106.68,260.6 106.68,266.7 U1.30
  Bottom Layer w0.254: v1(62.48,76.96) 62.23,76.71 62.23,13.97 U24.3
PG13: length 106.3
  Top Layer w0.254: v1(72.64,224.79) 107.95,260.1 U1.29
  Bottom Layer w0.254: v1(72.64,224.79) 72.9,224.54 72.9,187.2 U12.3
SW+: length 645.3
  Top Layer w0.254: U7.1 59.77,222.25 v1(65.79,222.25) ; U7.1 v1(52.66,220.98) ; U7.1 U10.1 U12.1 U14.1 U16.1 U18.1 U20.1 U22.1 U24.1 ; v1(141.74,229.62) 188.98,276.86 R28.2 198.38,277.88 212.42,277.88 U3.1 ; v1(132.34,229.62) 131.07,230.89 116.59,230.89 115.07,229.36 95.77,229.36 87.38,220.98 71.89,220.98 v1(70.37,222.5)
  Bottom Layer w0.254: v1(52.66,220.98) 51.39,219.71 17.61,219.71 ; v1(141.74,229.62) v1(132.34,229.62) ; U23.1 U21.1 U19.1 U17.1 U15.1 U13.1 U11.1 U8.1 17.61,202.95 17.61,219.71 ; 17.61,219.71 16.59,219.71 U6.1 ; v1(70.37,222.5) 66.05,222.5 v1(65.79,222.25)
$1N2371: length 8.6
  Bottom Layer w0.254: U6.5 24.05,222.25 19.09,222.25 U6.2
$1N4179: length 8.6
  Top Layer w0.254: U7.5 67.23,219.71 63.03,219.71 61.76,220.98 U7.2
$1N4270: length 8.6
  Top Layer w0.254: U8.2 19.09,199.39 24.05,199.39 U8.5
$1N4523: length 8.6
  Top Layer w0.254: U10.2 62.27,199.39 67.23,199.39 U10.5
$1N4533: length 8.6
  Top Layer w0.254: U11.5 24.05,179.07 19.09,179.07 U11.2
$1N4543: length 8.6
  Top Layer w0.254: U12.5 67.23,176.53 62.27,176.53 U12.2
$1N4796: length 8.6
  Top Layer w0.254: U13.2 19.09,151.13 24.05,151.13 U13.5
$1N4806: length 8.6
  Top Layer w0.254: U14.2 62.27,151.13 67.23,151.13 U14.5
$1N4816: length 8.6
  Top Layer w0.254: U15.2 19.09,125.73 24.05,125.73 U15.5
$1N5069: length 8.6
  Top Layer w0.254: U16.2 62.27,128.27 67.23,128.27 U16.5
$1N5079: length 8.6
  Top Layer w0.254: U17.2 19.09,105.41 24.05,105.41 U17.5
$1N5089: length 8.6
  Top Layer w0.254: U18.2 62.27,105.41 67.23,105.41 U18.5
$1N5342: length 8.6
  Top Layer w0.254: U19.2 19.09,74.93 24.05,74.93 U19.5
$1N5352: length 8.6
  Top Layer w0.254: U20.2 62.27,74.93 67.23,74.93 U20.5
$1N5362: length 8.6
  Top Layer w0.254: U21.5 24.05,44.45 19.09,44.45 U21.2
$1N5615: length 8.6
  Top Layer w0.254: U22.5 67.23,46.99 62.27,46.99 U22.2
$1N5625: length 8.6
  Top Layer w0.254: U23.2 19.09,11.43 24.05,11.43 U23.5
$1N5635: length 8.6
  Top Layer w0.254: U24.2 62.27,11.43 67.23,11.43 U24.5
$1N6166: length 18.4
  Bottom Layer w0.254: CN1.2 133.52,218.63 RLY1.3
$1N6202: length 18.9
  Top Layer w0.254: R1.2 125.21,220.98 CN1.1
$1N6298: length 8.6
  Bottom Layer w0.254: U3.2 219.75,273.05 224.71,273.05 U3.5
$1N6468: length 18.4
  Bottom Layer w0.254: RLY2.3 133.52,198.31 CN2.2
$1N6472: length 20
  Top Layer w0.254: R2.2 127.75,200.66 CN2.1
$1N6640: length 20
  Top Layer w0.254: R3.2 127.75,177.8 CN3.1
$1N6645: length 18.4
  Bottom Layer w0.254: RLY3.3 133.52,175.45 CN3.2
$1N7138: length 18.4
  Bottom Layer w0.254: RLY4.3 133.52,150.05 CN4.2
$1N7142: length 18.9
  Top Layer w0.254: R4.2 125.21,152.4 CN4.1
$1N7151: length 18.4
  Bottom Layer w0.254: CN5.2 133.52,127.19 RLY5.3
$1N7155: length 18.9
  Top Layer w0.254: CN5.1 125.75,137.16 R5.2
$1N7164: length 18.4
  Bottom Layer w0.254: CN6.2 133.52,101.79 RLY6.3
$1N7168: length 18.9
  Top Layer w0.254: R6.2 125.21,104.14 CN6.1
$1N7666: length 19.4
  Bottom Layer w0.254: RLY7.3 130.98,73.85 CN7.2
$1N7670: length 17.9
  Top Layer w0.254: CN7.1 122.67,78.74 R7.2
$1N7679: length 18.4
  Bottom Layer w0.254: CN8.2 133.52,43.37 RLY8.3
$1N7683: length 19.8
  Top Layer w0.254: 117.54,55.22 127.05,45.72 CN8.1
$1N7692: length 18.4
  Bottom Layer w0.254: RLY9.3 133.52,10.35 CN9.2
$1N7696: length 18.9
  Top Layer w0.254: R9.2 125.21,12.7 CN9.1
$1N9148: length 20.9
  Bottom Layer w0.254: CN10.2 197.02,218.63 RLY10.3
$1N9152: length 21.5
  Top Layer w0.254: CN10.1 186.17,220.98 R10.2
$1N9161: length 22
  Bottom Layer w0.254: CN11.2 194.48,198.31 RLY11.3
$1N9165: length 20.4
  Top Layer w0.254: R11.2 183.63,203.2 CN11.1
$1N9174: length 20.9
  Bottom Layer w0.254: CN12.2 197.02,175.45 RLY12.3
$1N9178: length 21.5
  Top Layer w0.254: R12.2 186.17,177.8 CN12.1
$1N9187: length 20.9
  Bottom Layer w0.254: RLY13.3 197.02,150.05 CN13.2
$1N9191: length 21.5
  Top Layer w0.254: CN13.1 186.17,152.4 R13.2
$1N9200: length 20.9
  Bottom Layer w0.254: RLY14.3 197.02,127.19 CN14.2
$1N9204: length 21.5
  Top Layer w0.254: R14.2 186.17,129.54 CN14.1
$1N9213: length 20.9
  Bottom Layer w0.254: RLY15.3 197.02,101.79 CN15.2
$1N9217: length 21.5
  Top Layer w0.254: R15.2 186.17,104.14 CN15.1
$1N9226: length 20.9
  Bottom Layer w0.254: RLY16.3 197.02,73.85 CN16.2
$1N9230: length 21.5
  Top Layer w0.254: R16.2 186.17,76.2 CN16.1
$1N9239: length 20.9
  Bottom Layer w0.254: CN17.2 197.02,43.37 RLY17.3
$1N9243: length 21.5
  Top Layer w0.254: R17.2 186.17,45.72 CN17.1
$1N9252: length 20.9
  Bottom Layer w0.254: CN18.2 197.02,10.35 RLY18.3
$1N9256: length 21.5
  Top Layer w0.254: R18.2 186.17,12.7 CN18.1
$1N10732: length 20.9
  Bottom Layer w0.254: RLY19.3 260.52,218.63 CN19.2
$1N10736: length 21.5
  Top Layer w0.254: R19.2 249.67,220.98 CN19.1
$1N10745: length 20.9
  Bottom Layer w0.254: RLY20.3 260.52,198.31 CN20.2
$1N10749: length 21.5
  Top Layer w0.254: R20.2 249.67,200.66 CN20.1
$1N10758: length 20.9
  Bottom Layer w0.254: RLY21.3 260.52,175.45 CN21.2
$1N10762: length 21.5
  Top Layer w0.254: R21.2 249.67,177.8 CN21.1
$1N10771: length 20.9
  Bottom Layer w0.254: CN22.2 260.52,150.05 RLY22.3
$1N10775: length 21.5
  Top Layer w0.254: R22.2 249.67,152.4 CN22.1
$1N10784: length 21.4
  Bottom Layer w0.254: RLY23.3 260.22,126.89 CN23.2
$1N10788: length 21.5
  Top Layer w0.254: CN23.1 249.67,129.54 R23.2
$1N10797: length 20.9
  Bottom Layer w0.254: CN24.2 260.52,101.79 RLY24.3
$1N10801: length 21.5
  Top Layer w0.254: R24.2 249.67,104.14 CN24.1
$1N10810: length 20.9
  Bottom Layer w0.254: CN25.2 260.52,73.85 RLY25.3
$1N10814: length 21.5
  Top Layer w0.254: R25.2 249.67,76.2 CN25.1
$1N10823: length 20.9
  Bottom Layer w0.254: RLY26.3 260.52,43.37 CN26.2
$1N10827: length 21.5
  Top Layer w0.254: CN26.1 249.67,45.72 R26.2
$1N10836: length 20.9
  Bottom Layer w0.254: CN27.2 260.52,10.35 RLY27.3
$1N10840: length 21.5
  Top Layer w0.254: CN27.1 249.67,12.7 R27.2

## Copper pours and planes (outline as drawn; the poured copper is in the pictures)
GND on Top Layer: 0.25,317.25 276.61,317.25 276.61,0.25 0.25,0.25
GND on Bottom Layer: 0.25,317.25 276.61,317.25 276.61,0.25 0.25,0.25

Small or netless copper shapes (teardrops, artwork), in the pictures only: 311 on Top Layer, 270 on Bottom Layer
